# Altium project linux_board.PrjPcb
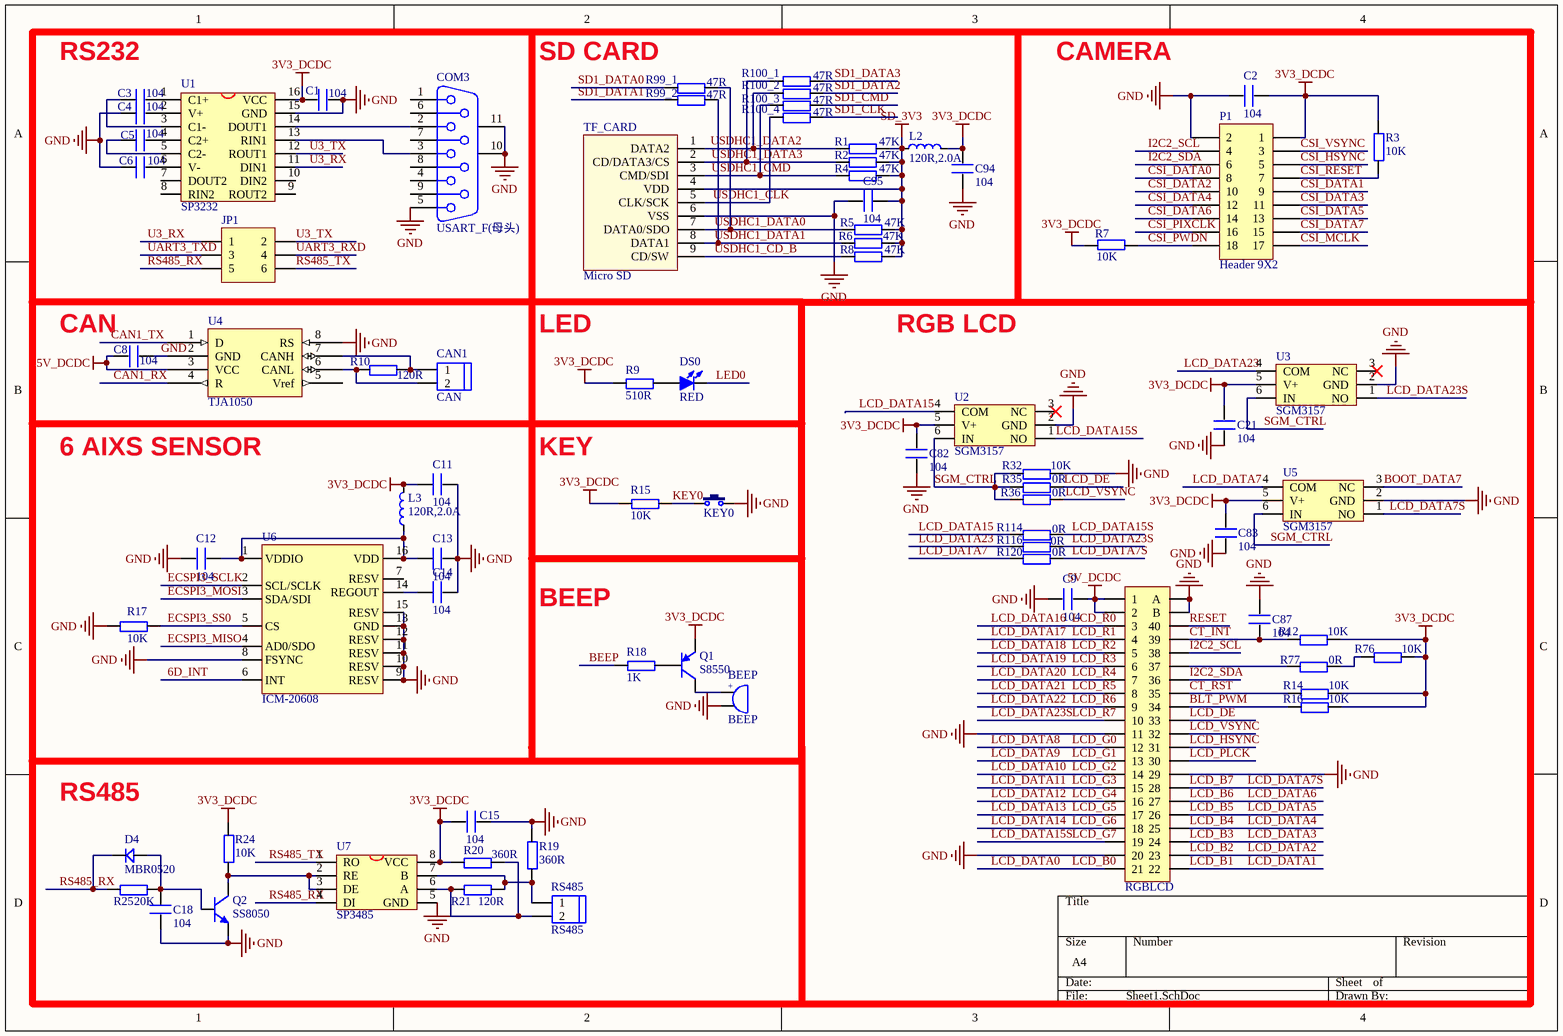
[diagram p0: Sheet1.SchDoc]
5 sheets, 282 parts. Net scope: global (net labels, ports and power ports of the same name join across sheets).
Board file: linux_board_PCB.PcbDoc
Sheets:
  Sheet1.SchDoc
  Sheet2.SchDoc
  Sheet3.SchDoc
  Sheet4.SchDoc
  Sheet5.SchDoc

## Sheet Sheet1.SchDoc
size A4

### Parts
BEEP  BEEP  [BEEP 5x9x5.5]
C1  104  [C 0603]
C2  104  [C 0603]
C3  104  [C 0603]
C4  104  [C 0603]
C5  104  [C 0603]
C6  104  [C 0603]
C8  104  [C 0603]
C9  104  [C 0603]
C11  104  [C 0603]
C12  104  [C 0603]
C13  104  [C 0603]
C14  104  [C 0603]
C15  104  [C 0603]
C18  104  [C 0603]
C21  104  [C 0603]
C82  104  [C 0603]
C83  104  [C 0603]
C87  104  [C 0603]
C94  104  [C 0603]
C95  104  [C 0603]
CAN1  CAN  [KF301-2P]
COM3  USART_F(母头)  [DB9/P_A]
D4  MBR0520  [SOD-123F]
DS0  RED  [LED 0805R]
JP1  RS232/RS485  [HDR-3X2]  (value not drawn)
KEY0  KEY  [TSW DIP-6*6*5 - 2]  (value not drawn)
L2  120R,2.0A  [L 0603]
L3  120R,2.0A  [L 0603]
P1  Header 9X2  [HDR2X9]
Q1  S8550  [SOT23-3L]
Q2  SS8050  [SOT23-3N]
R1  47K  [R 0603]
R2  47K  [R 0603]
R3  10K  [R 0603]
R4  47K  [R 0603]
R5  47K  [R 0603]
R6  47K  [R 0603]
R7  10K  [R 0603]
R8  47K  [R 0603]
R9  510R  [R 0603]
R10  120R  [R 0603]
R12  10K  [R 0603]
R14  10K  [R 0603]
R15  10K  [R 0603]
R16  10K  [R 0603]
R17  10K  [R 0603]
R18  1K  [R 0603]
R19  360R  [R 0603]
R20  360R  [R 0603]
R21  120R  [R 0603]
R24  10K  [R 0603]
R25  20K  [R 0603]
R32  10K  [R 0603]
R35  0R  [R 0603]
R36  0R  [R 0603]
R76  10K  [R 0603]
R77  0R  [R 0603]
R99_1  47R  [R 0603]
R99_2  47R  [R 0603]
R100_1  47R  [R 0603]
R100_2  47R  [R 0603]
R100_3  47R  [R 0603]
R100_4  47R  [R 0603]
R114  0R  [R 0603]
R116  0R  [R 0603]
R120  0R  [R 0603]
RGBLCD  RGBLCD  [FPC0.5-TOP40P]  (value not drawn)
RS485  RS485  [KF301-2P]
TF_CARD  Micro SD  [Micro SD]
U1  SP3232  [SOP16_N]
U2  SGM3157  [SOT363-6L]
U3  SGM3157  [SOT363-6L]
U4  TJA1050  [SOP8_N]
U5  SGM3157  [SOT363-6L]
U6  ICM-20608  [LGA-16-3*3*0.75]
U7  SP3485  [SOP8_N]

### Nets
3V3_DCDC: C1.1 C2.1 C11.1 C15.1 C21.2 C82.2 C83.2 C94.2 L2.2 L3.2 P1.1 Q1.2(E) R3.2 R7.2 R9.1 R12.2 R14.2 R15.1 R16.2 R20.1 R24.2 R76.2 U1.16(VCC) U2.5(V+) U3.5(V+) U5.5(V+) U7.8(VCC)
5V_DCDC: C8.1 C9.1 RGBLCD.1 RGBLCD.2 U4.3(VCC)
GND: BEEP.2 C1.2 C2.2 C4.1 C6.1 C8.2 C9.2 C11.2 C12.1 C13.2 C14.2 C15.2 C18.1 C21.1 C82.1 C83.1 C87.1 C94.1 C95.1 COM3.5 COM3.10(MH1) COM3.11(MH2) KEY0.2 P1.2 Q2.2(E) R17.1 R19.2 R32.2 RGBLCD.11 RGBLCD.20 RGBLCD.29 RGBLCD.41(B) RGBLCD.42(A) TF_CARD.6(VSS) U1.15(GND) U2.2(GND) U3.2(GND) U4.2(GND) U4.8(RS) U5.2(GND) U6.8(FSYNC) U6.9(RESV) U6.10(RESV) U6.11(RESV) U6.12(RESV) U6.13(GND) U6.15(RESV) U7.5(GND)
SD_3V3: C95.2 L2.1 R1.2 R2.2 R4.2 R5.2 R6.2 R8.2 TF_CARD.4(VDD)
6D_INT: U6.6(INT)
BEEP: R18.1
BLT_PWM: R16.1 RGBLCD.34
BOOT_DATA7: U5.3(NC)
CAN1_RX: U4.4(R)
CAN1_TX: U4.1(D)
CSI_DATA0: P1.8
CSI_DATA1: P1.9
CSI_DATA2: P1.10
CSI_DATA3: P1.11
CSI_DATA4: P1.12
CSI_DATA5: P1.13
CSI_DATA6: P1.14
CSI_DATA7: P1.15
CSI_HSYNC: P1.5
CSI_MCLK: P1.17
CSI_PIXCLK: P1.16
CSI_PWDN: P1.18 R7.1
CSI_RESET: P1.7 R3.1
CSI_VSYNC: P1.3
CT_INT: C87.2 R12.1 RGBLCD.39
CT_RST: R14.1 RGBLCD.35
ECSPI3_MISO: U6.4(AD0/SDO)  [project net CAN2_RX]
ECSPI3_MOSI: U6.3(SDA/SDI)  [project net CAN2_TX]
ECSPI3_SCLK: U6.2(SCL/SCLK)
ECSPI3_SS0: R17.2 U6.5(CS)
I2C2_SCL: P1.4 RGBLCD.38
I2C2_SDA: P1.6 RGBLCD.36
KEY0: KEY0.1 R15.2
LCD_B0: RGBLCD.21  [also labelled LCD_DATA0]
LCD_B1: RGBLCD.22  [also labelled LCD_DATA1]
LCD_B2: RGBLCD.23  [also labelled LCD_DATA2]
LCD_B3: RGBLCD.24  [also labelled LCD_DATA3]
LCD_B4: RGBLCD.25  [also labelled LCD_DATA4]
LCD_B5: RGBLCD.26  [also labelled LCD_DATA5]
LCD_B6: RGBLCD.27  [also labelled LCD_DATA6]
LCD_B7: R120.2 RGBLCD.28 U5.1(NO)  [also labelled LCD_DATA7S]
LCD_DATA7: R120.1 U5.4(COM)
LCD_DATA8: RGBLCD.12  [also labelled LCD_G0]
LCD_DATA9: RGBLCD.13  [also labelled LCD_G1]
LCD_DATA10: RGBLCD.14  [also labelled LCD_G2]
LCD_DATA11: RGBLCD.15  [also labelled LCD_G3]
LCD_DATA12: RGBLCD.16  [also labelled LCD_G4]
LCD_DATA13: RGBLCD.17  [also labelled LCD_G5]
LCD_DATA14: RGBLCD.18  [also labelled LCD_G6]
LCD_DATA15: R114.1 U2.4(COM)
LCD_DATA15S: R114.2 RGBLCD.19 U2.1(NO)  [also labelled LCD_G7]
LCD_DATA16: RGBLCD.3  [also labelled LCD_R0]
LCD_DATA17: RGBLCD.4  [also labelled LCD_R1]
LCD_DATA18: RGBLCD.5  [also labelled LCD_R2]
LCD_DATA19: RGBLCD.6  [also labelled LCD_R3]
LCD_DATA20: RGBLCD.7  [also labelled LCD_R4]
LCD_DATA21: RGBLCD.8  [also labelled LCD_R5]
LCD_DATA22: RGBLCD.9  [also labelled LCD_R6]
LCD_DATA23: R116.1 U3.4(COM)
LCD_DATA23S: R116.2 RGBLCD.10 U3.1(NO)  [also labelled LCD_R7]
LCD_DE: R35.2 RGBLCD.33
LCD_HSYNC: RGBLCD.31
LCD_PLCK: RGBLCD.30
LCD_VSYNC: R36.2 RGBLCD.32
LED0: DS0.2(K)  [project net GPIO3]
RESET: RGBLCD.40
RS485_RX: D4.2(K) JP1.5 R25.1 U7.4(DI)
RS485_TX: JP1.6 U7.1(RO)
SD1_CLK: R100_4.2
SD1_CMD: R100_3.2
SD1_DATA0: R99_1.1
SD1_DATA1: R99_2.1
SD1_DATA2: R100_2.2
SD1_DATA3: R100_1.2
SGM_CTRL: R32.1 R35.1 R36.1 U2.6(IN) U3.6(IN) U5.6(IN)
U3_RX: JP1.1 U1.11(DIN1)
U3_TX: JP1.2 U1.12(ROUT1)
UART3_RXD: JP1.4
UART3_TXD: JP1.3
USDHC1_CD_B: R8.1 TF_CARD.9(CD/SW)  [project net UART1_RTS]
USDHC1_CLK: R100_4.1 TF_CARD.5(CLK/SCK)
USDHC1_CMD: R4.1 R100_3.1 TF_CARD.3(CMD/SDI)
USDHC1_DATA0: R5.1 R99_1.2 TF_CARD.7(DATA0/SDO)
USDHC1_DATA1: R6.1 R99_2.2 TF_CARD.8(DATA1)
USDHC1_DATA2: R1.1 R100_2.1 TF_CARD.1(DATA2)
USDHC1_DATA3: R2.1 R100_1.1 TF_CARD.2(CD/DATA3/CS)
NetBEEP_1: BEEP.1 Q1.3(C)
NetC3_1: C3.1 U1.3(C1-)
NetC3_2: C3.2 U1.1(C1+)
NetC4_2: C4.2 U1.2(V+)
NetC5_1: C5.1 U1.5(C2-)
NetC5_2: C5.2 U1.4(C2+)
NetC6_2: C6.2 U1.6(V-)
NetC12_2: C12.2 C13.1 L3.1 U6.1(VDDIO) U6.16(VDD)
NetC14_1: C14.1 U6.14(REGOUT)
NetC18_2: C18.2 D4.1(A) Q2.1(B) R25.2
NetCAN1_1: CAN1.1 R10.2 U4.7(CANH)
NetCAN1_2: CAN1.2 R10.1 U4.6(CANL)
NetCOM3_2: COM3.2 U1.14(DOUT1)
NetCOM3_3: COM3.3 U1.13(RIN1)
NetDS0_1: DS0.1(A) R9.2
NetQ1_1: Q1.1(B) R18.2
NetQ2_3: Q2.3(C) R24.1 U7.2(RE) U7.3(DE)
NetR19_1: R19.1 R21.2 RS485.1 U7.7(B)
NetR20_2: R20.2 R21.1 RS485.2 U7.6(A)
NetR76_1: R76.1 R77.2
NetR77_1: R77.1 RGBLCD.37

Not connected (* = marked no-connect by the designer): COM3 1 4 6 7 8 9; U1 7(DOUT2) 8(RIN2) 9(ROUT2) 10(DIN2); U2 3(NC)*; U3 3(NC)*; U4 5(Vref); U6 7(RESV)

### Notes on the sheet
- RS232
- SD CARD
- CAMERA
- (near C8) CAN
- LED
- RGB LCD
- 6 AIXS SENSOR
- KEY
- BEEP
- (near D4) RS485
- (in symbol BEEP) +

### Library data of the parts
BEEP = BEEP: 蜂鸣器; 版权归属: 源创客; BOM名称: 蜂鸣器; 学习资源: www.ooocke.com
C1-C6 C8 C9 C11-C15 C18 C21 C82 C83 C87 C94 C95 = C
CAN1 RS485 = HEAD2
COM3 = DB9: 9针串口; 版权归属: 源创客; BOM名称: 9针串口; 学习资源: www.ooocke.com
D4 = SS14: 肖特基二极管; 版权归属: 源创客; 属性: 40V/1A; BOM名称: 肖特基二极管; 学习资源: www.ooocke.com
DS0 = LED-SMD: 贴片LED; 版权归属: 源创客; BOM名称: 贴片LED; 学习资源: www.ooocke.com
JP1 = Header 3X2: 3*2P接插件; 版权归属: 源创客; BOM名称: 3*2P接插件; 学习资源: www.ooocke.com
KEY0 = KEY: 按键; BOM名称: 3x6轻触开关; 版权归属: 源创客; 学习资源: www.ooocke.com
L2 L3 = L: 小功率贴片电感磁珠; 版权归属: 源创客; BOM名称: 小功率贴片电感; 学习资源: www.ooocke.com
P1 = Header 9X2: Header, 9-Pin, Dual row; LatestRevisionDate: 17-Jul-2002; LatestRevisionNote: Re-released for DXP Platform.; Publisher: Altium Limited
Q1 = 8550-SMD: 高频放大-PNP型; 版权归属: 源创客; 属性: 40V 1.5A 1W 100MHZ; BOM名称: 高频放大-PNP型; 学习资源: www.ooocke.com
Q2 = 8050-SMD: 高频放大-NPN型; 版权归属: 源创客; 属性: 40V 1.5A 1W 100MHZ; BOM名称: 高频放大-NPN型; 学习资源: www.ooocke.com
R1-R10 R12 R14-R21 R24 R25 R32 R35 R36 R76 R77 R99_1 R99_2 R100_1-R100_4 R114 R116 R120 = R
RGBLCD = RGBLCD: 16*2P接插件; 版权归属: 源创客; BOM名称: 16*2P接插件; 学习资源: www.ooocke.com
TF_CARD = Micro SD: Micro SD卡; 版权归属: 源创客; BOM名称: Micro SD卡; 学习资源: www.ooocke.com
U1 = MAX3232
U2 U3 U5 = SGM3157: 单路双掷模拟开关
U4 = SN65HVD230D
U6 = ICM20608: 三轴陀螺仪/三轴加速度计,
U7 = MAX3485

## Sheet Sheet2.SchDoc
size A4
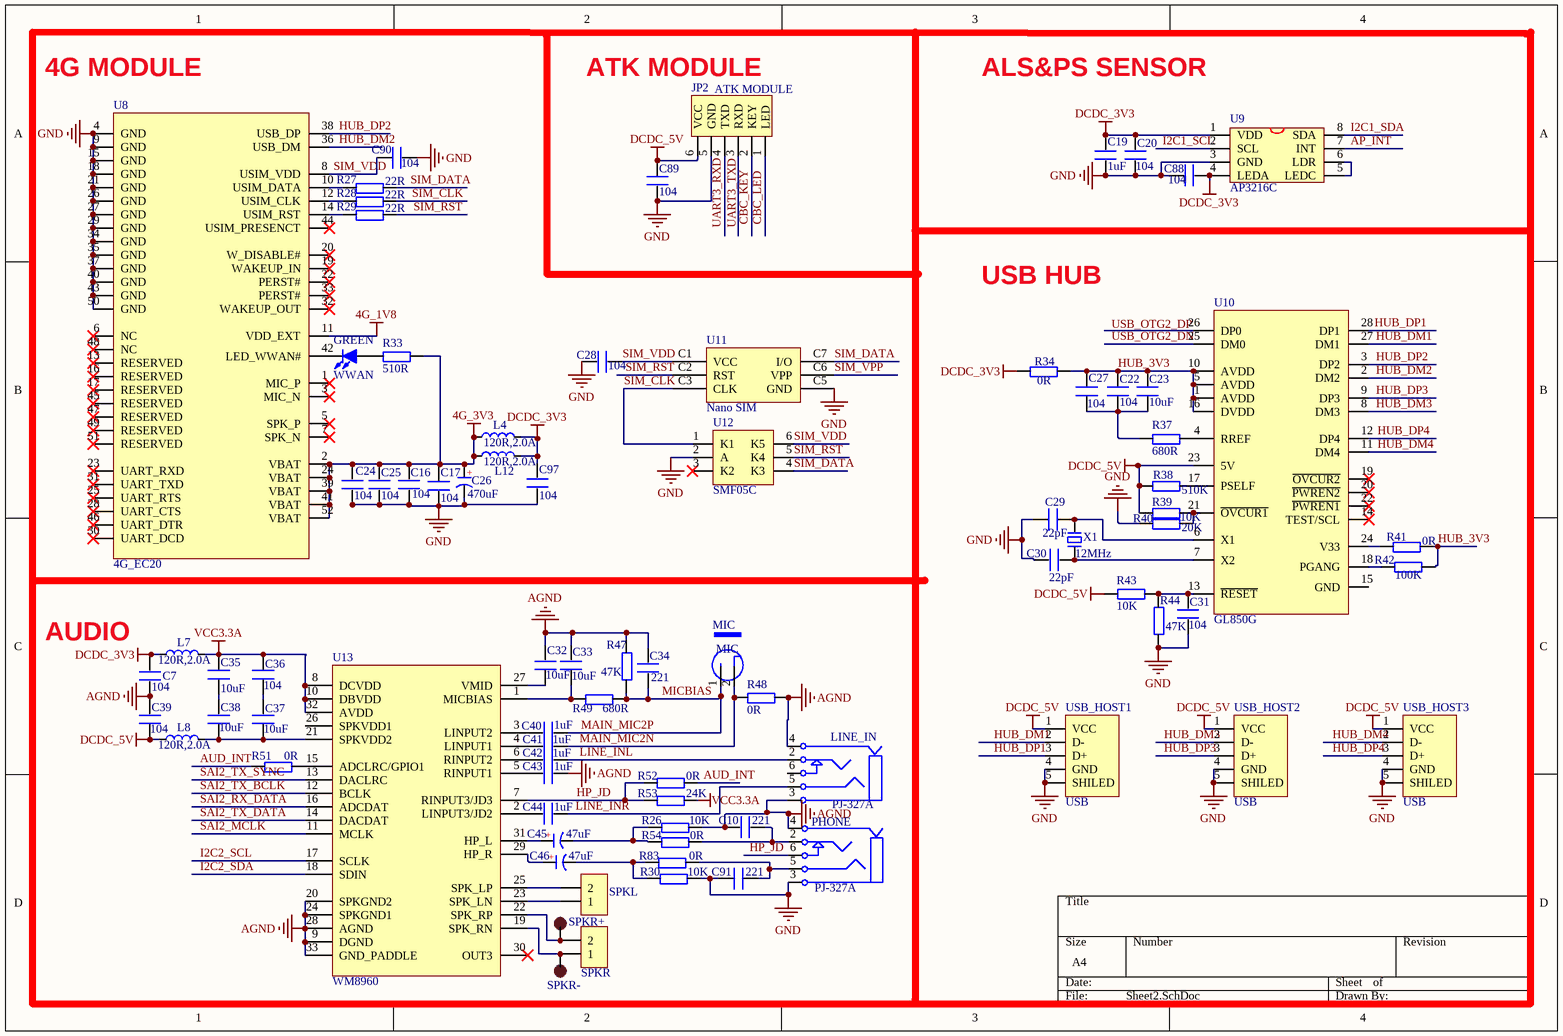
[diagram p1: Sheet2.SchDoc]

### Parts
C7  104  [C 0603]
C10  221  [C 0603]
C16  104  [C 0603]
C17  104  [C 0603]
C19  1uF  [C 0603]
C20  104  [C 0603]
C22  104  [C 0603]
C23  10uF  [C 0603]
C24  104  [C 0603]
C25  104  [C 0603]
C26  470uF  [CM D(6.3*5.4)]
C27  104  [C 0603]
C28  104  [C 0603]
C29  22pF  [C 0603]
C30  22pF  [C 0603]
C31  104  [C 0603]
C32  10uF  [C 0603]
C33  10uF  [C 0603]
C34  221  [C 0603]
C35  10uF  [C 0603]
C36  104  [C 0603]
C37  10uF  [C 0603]
C38  10uF  [C 0603]
C39  104  [C 0603]
C40  1uF  [C 0603]
C41  1uF  [C 0603]
C42  1uF  [C 0603]
C43  1uF  [C 0603]
C44  1uF  [C 0603]
C45  47uF  [CM D(6.3*5.4)]
C46  47uF  [CM D(6.3*5.4)]
C88  104  [C 0603]
C89  104  [C 0603]
C90  104  [C 0603]
C91  221  [C 0603]
C97  104  [C 0603]
GREEN  WWAN  [LED 0805R]
JP2  ATK MODULE  [HEAD6]
L4  120R,2.0A  [L 0603]
L7  120R,2.0A  [L 0603]
L8  120R,2.0A  [L 0603]
L12  120R,2.0A  [L 0603]
LINE_IN  PJ-327A  [PJ327A]
MIC  MIC  [MIC-6022]
PHONE  PJ-327A  [PJ327A]
R26  10K  [R 0603]
R27  22R  [R 0603]
R28  22R  [R 0603]
R29  22R  [R 0603]
R30  10K  [R 0603]
R33  510R  [R 0603]
R34  0R  [R 0603]
R37  680R  [R 0603]
R38  510K  [R 0603]
R39  10K  [R 0603]
R40  20K  [R 0603]
R41  0R  [R 0603]
R42  100K  [R 0603]
R43  10K  [R 0603]
R44  47K  [R 0603]
R47  47K  [R 0603]
R48  0R  [R 0603]
R49  680R  [R 0603]
R51  0R  [R 0603]
R52  0R  [R 0603]
R53  24K  [R 0603]
R54  0R  [R 0603]
R83  0R  [R 0603]
SPKL  SPKL  [XH2.54-2P_H]  (value not drawn)
SPKR  SPKL  [XH2.54-2P_H]  (value not drawn)
SPKR+  SPK+  [TP-1.5]  (value not drawn)
SPKR-  SPK+  [TP-1.5]  (value not drawn)
U8  4G_EC20  [Mini PCIE 52P]
U9  AP3216C  [QFN8]
U10  GL850G  [SSOP28_L]
U11  Nano SIM  [Nano SIM 7P]
U12  SMF05C  [SOT363-6L]
U13  WM8960  [QFN32 5x5_L]
USB_HOST1  USB  [USB-A/S_E]
USB_HOST2  USB  [USB-A/S_E]
USB_HOST3  USB  [USB-A/S_E]
X1  12MHz  [XTAL-49S DIP]

### Nets
4G_1V8: U8.11(VDD_EXT)
4G_3V3: C16.2 C17.2 C24.2 C25.2 C26.1(A) L4.1 L12.1 R33.2 U8.2(VBAT) U8.24(VBAT) U8.39(VBAT) U8.41(VBAT) U8.52(VBAT)
AGND: C7.1 C10.1 C32.1 C33.2 C34.2 C39.2 C43.2 LINE_IN.3 LINE_IN.4 PHONE.4 R26.2 R47.2 R48.2 U13.9(DGND) U13.20(SPKGND2) U13.24(SPKGND1) U13.28(AGND) U13.33(GND_PADDLE)
DCDC_3V3: C7.2 C19.2 C20.2 C88.1 C97.2 L4.2 L7.1 L12.2 R34.1 U9.1(VDD) U9.4(LEDA)
DCDC_5V: C39.1 C89.1 JP2.6(VCC) L8.1 R38.1 R39.1 R43.1 U10.23(5V) USB_HOST1.1(VCC) USB_HOST2.1(VCC) USB_HOST3.1(VCC)  [project net CORE_5V]
GND: C16.1 C17.1 C19.1 C20.1 C24.1 C25.1 C26.2(K) C28.2 C29.2 C30.2 C31.2 C88.2 C89.2 C90.2 C91.1 C97.1 JP2.5(GND) PHONE.3 R30.2 R40.1 R44.1 U8.4(GND) U8.9(GND) U8.15(GND) U8.18(GND) U8.21(GND) U8.26(GND) U8.27(GND) U8.29(GND) U8.34(GND) U8.35(GND) U8.37(GND) U8.40(GND) U8.43(GND) U8.50(GND) U9.3(GND) U11.C5(GND) U12.2(A) USB_HOST1.4(GND) USB_HOST1.5(SHILED) USB_HOST2.4(GND) USB_HOST2.5(SHILED) USB_HOST3.4(GND) USB_HOST3.5(SHILED)
VCC3.3A: C35.2 C36.2 L7.2 R53.2 U13.8(DCVDD) U13.10(DBVDD) U13.32(AVDD)
AP_INT: U9.7(INT)
AUD_INT: R51.1 R52.2
CBC_KEY: JP2.2(KEY)
CBC_LED: JP2.1(LED)
HP_JD: PHONE.6 R52.1 R53.1 U13.7(RINPUT3/JD3)
HUB_3V3: C22.2 C23.2 C27.2 R34.2 R41.2 R42.2 U10.1(AVDD) U10.5(AVDD) U10.10(AVDD) U10.16(DVDD)
HUB_DM1: U10.27(DM1) USB_HOST1.2(D-)
HUB_DM2: U8.36(USB_DM) U10.2(DM2)
HUB_DM3: U10.8(DM3) USB_HOST2.2(D-)
HUB_DM4: U10.11(DM4) USB_HOST3.2(D-)
HUB_DP1: U10.28(DP1) USB_HOST1.3(D+)
HUB_DP2: U8.38(USB_DP) U10.3(DP2)
HUB_DP3: U10.9(DP3) USB_HOST2.3(D+)
HUB_DP4: U10.12(DP4) USB_HOST3.3(D+)
I2C1_SCL: U9.2(SCL)
I2C1_SDA: U9.8(SDA)
I2C2_SCL: U13.17(SCLK)
I2C2_SDA: U13.18(SDIN)
LINE_INL: C42.2 LINE_IN.2
LINE_INR: C44.2 LINE_IN.5
MAIN_MIC2N: C41.2 MIC.2(GND) R48.1
MAIN_MIC2P: C34.1 C40.2 MIC.1(VCC) R47.1 R49.2  [also labelled MICBIAS]
SAI2_MCLK: U13.11(MCLK)  [project net JTAG_TMS]
SAI2_RX_DATA: U13.16(ADCDAT)  [project net JTAG_TCK]
SAI2_TX_BCLK: U13.12(BCLK)  [project net JTAG_TDI]
SAI2_TX_DATA: U13.14(DACDAT)  [project net JTAG_nTRST]
SAI2_TX_SYNC: U13.13(DACLRC)  [project net JTAG_TDO]
SIM_CLK: R28.2 U11.C3(CLK) U12.1(K1)
SIM_DATA: R27.2 U11.C7(I/O) U12.4(K3)
SIM_RST: R29.2 U11.C2(RST) U12.5(K4)
SIM_VDD: C28.1 C90.1 U8.8(USIM_VDD) U11.C1(VCC) U12.6(K5)
SIM_VPP: U11.C6(VPP)
UART3_RXD: JP2.4(TXD)
USB_OTG2_DN: U10.25(DM0)
NetC10_2: C10.2 PHONE.2 R54.2
NetC22_1: C22.1 C23.1 C27.1 R37.1
NetC29_1: C29.1 U10.6(X1) X1.2
NetC30_1: C30.1 U10.7(X2) X1.1
NetC31_1: C31.1 R43.2 R44.2 U10.13(~{RESET})
NetC32_2: C32.2 U13.27(VMID)
NetC33_1: C33.1 R49.1 U13.1(MICBIAS)
NetC35_1: C35.1 C38.2
NetC36_1: C36.1 C37.2
NetC37_1: C37.1 C38.1 L8.2 U13.21(SPKVDD2)
NetC40_1: C40.1 U13.3(LINPUT2)
NetC41_1: C41.1 U13.4(LINPUT1)
NetC42_1: C42.1 U13.6(RINPUT2)
NetC43_1: C43.1 U13.5(RINPUT1)
NetC44_1: C44.1 U13.2(LINPUT3/JD2)
NetC45_1: C45.1(A) U13.31(HP_L)
NetC45_2: C45.2(K) R26.1 R54.1
NetC46_1: C46.1(A) U13.29(HP_R)
NetC46_2: C46.2(K) R30.1 R83.1
NetC91_2: C91.2 PHONE.5 R83.2
NetGREEN_1: GREEN.1(A) R33.1
NetGREEN_2: GREEN.2(K) U8.42(LED_WWAN#)
NetR27_1: R27.1 U8.10(USIM_DATA)
NetR28_1: R28.1 U8.12(USIM_CLK)
NetR29_1: R29.1 U8.14(USIM_RST)
NetR37_2: R37.2 U10.4(RREF)
NetR38_2: R38.2 U10.17(PSELF)
NetR39_2: R39.2 R40.2 U10.21(~{OVCUR1})
NetR41_1: R41.1 U10.24(V33)
NetR42_1: R42.1 U10.18(PGANG)
NetR51_2: R51.2 U13.15(ADCLRC/GPIO1)
NetSPKL_1: SPKL.1 U13.23(SPK_LN)
NetSPKL_2: SPKL.2 U13.25(SPK_LP)
NetSPKR_1: SPKR.1 SPKR-.1 U13.19(SPK_RN)
NetSPKR_2: SPKR.2 SPKR+.1 U13.22(SPK_RP)
NetU9_5: U9.5(LEDC) U9.6(LDR)

Not connected (* = marked no-connect by the designer): JP2 3(RXD); LINE_IN 6; U8 1(MIC_P)* 3(MIC_N)* 5(SPK_P)* 6(NC)* 7(SPK_N)* 13(RESERVED)* 16(RESERVED)* 17(RESERVED)* 19(WAKEUP_IN)* 20(W_DISABLE#)* 22(PERST#)* 23(UART_RXD)* 25(UART_RTS)* 28(UART_CTS)* 30(UART_DCD)* 31(UART_TXD)* 32(WAKEUP_OUT)* 33(PERST#)* 44(USIM_PRESENCT)* 45(RESERVED)* 46(UART_DTR)* 47(RESERVED)* 48(NC)* 49(RESERVED)* 51(RESERVED)*; U10 14(TEST/SCL)* 15(GND) 19(~{OVCUR2})* 20(~{PWREN2})* 22(~{PWREN1})* 26(DP0); U11 C4(NC); U12 3(K2)*; U13 26(SPKVDD1) 30(OUT3)*

### Notes on the sheet
- (near U8) 4G MODULE
- (near JP2) ATK MODULE
- ALS&PS SENSOR
- USB HUB
- AUDIO
- Labels drawn without touching a wire or pin: UART3_TXD, USB_OTG2_DP
- (in symbol C-CM) +

### Library data of the parts
C7 C10 C16 C17 C19 C20 C22-C25 C27-C44 C88-C91 C97 = C
C26 C45 C46 = C-CM: 贴片电解电容; 版权归属: 源创客; BOM名称: 贴片电解电容; 学习资源: www.ooocke.com
GREEN = LED-SMD: 贴片LED; 版权归属: 源创客; BOM名称: 贴片LED; 学习资源: www.ooocke.com
JP2 = ATK-HC05
L4 L7 L8 L12 = L: 小功率贴片电感磁珠; 版权归属: 源创客; BOM名称: 小功率贴片电感; 学习资源: www.ooocke.com
R26-R30 R33 R34 R37-R44 R47-R49 R51-R54 R83 = R
SPKL SPKR = Header 2: 2P接插件; 版权归属: 源创客; BOM名称: 2P接插件; 学习资源: www.ooocke.com
SPKR+ SPKR- = TEST-POINT: 测试点
U8 = 4G-EC20
U9 = AP3216C: ALS+PS Sensor
USB_HOST1-USB_HOST3 = USB-A/S: USB-A型母接口; 版权归属: 源创客; BOM名称: USB-A型母接口; 学习资源: www.ooocke.com
X1 = XTAL-2P: 2脚无源晶振; BOM名称: 2脚晶振; 版权归属: 源创客; 学习资源: www.ooocke.com

## Sheet Sheet3.SchDoc
size A4
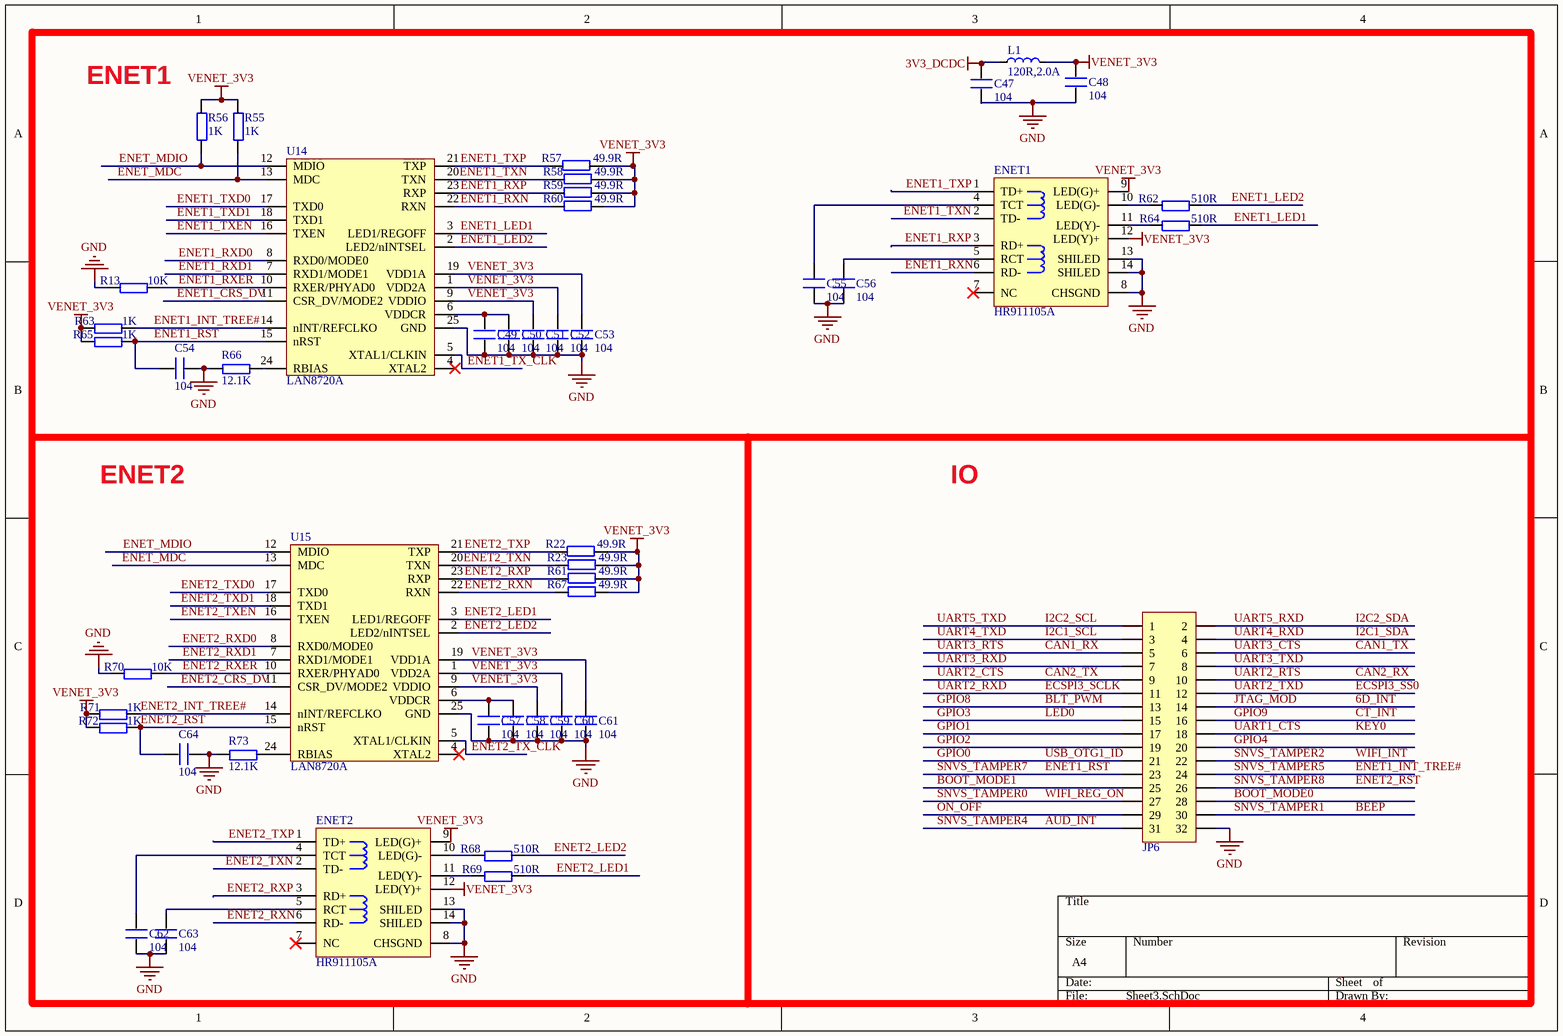
[diagram p2: Sheet3.SchDoc]

### Parts
C47  104  [C 0603]
C48  104  [C 0603]
C49  104  [C 0603]
C50  104  [C 0603]
C51  104  [C 0603]
C52  104  [C 0603]
C53  104  [C 0603]
C54  104  [C 0603]
C55  104  [C 0603]
C56  104  [C 0603]
C57  104  [C 0603]
C58  104  [C 0603]
C59  104  [C 0603]
C60  104  [C 0603]
C61  104  [C 0603]
C62  104  [C 0603]
C63  104  [C 0603]
C64  104  [C 0603]
ENET1  HR911105A  [RJ-45A12]
ENET2  HR911105A  [RJ-45A12]
JP6  Header 2X11  [HDR-16X2]  (value not drawn)
L1  120R,2.0A  [L 0603]
R13  10K  [R 0603]
R22  49.9R  [R 0603]
R23  49.9R  [R 0603]
R55  1K  [R 0603]
R56  1K  [R 0603]
R57  49.9R  [R 0603]
R58  49.9R  [R 0603]
R59  49.9R  [R 0603]
R60  49.9R  [R 0603]
R61  49.9R  [R 0603]
R62  510R  [R 0603]
R63  1K  [R 0603]
R64  510R  [R 0603]
R65  1K  [R 0603]
R66  12.1K  [R 0603]
R67  49.9R  [R 0603]
R68  510R  [R 0603]
R69  510R  [R 0603]
R70  10K  [R 0603]
R71  1K  [R 0603]
R72  1K  [R 0603]
R73  12.1K  [R 0603]
U14  LAN8720A  [QFN24]
U15  LAN8720A  [QFN24]

### Nets
3V3_DCDC: C47.2 L1.1
GND: C47.1 C48.1 C49.1 C50.1 C51.1 C52.1 C53.1 C54.1 C55.1 C56.1 C57.1 C58.1 C59.1 C60.1 C61.1 C62.1 C63.1 C64.1 ENET1.8(CHSGND) ENET1.13(SHILED) ENET1.14(SHILED) ENET2.8(CHSGND) ENET2.13(SHILED) ENET2.14(SHILED) JP6.32 R13.1 R66.1 R70.1 R73.1 U14.25(GND) U15.25(GND)
VENET_3V3: C48.2 C51.2 C52.2 C53.2 C59.2 C60.2 C61.2 ENET1.9(LED(G)+) ENET1.12(LED(Y)+) ENET2.9(LED(G)+) ENET2.12(LED(Y)+) L1.2 R22.1 R23.1 R55.2 R56.2 R57.1 R58.1 R59.1 R60.1 R61.1 R63.1 R65.1 R67.1 R71.1 R72.1 U14.1(VDD2A) U14.9(VDDIO) U14.19(VDD1A) U15.1(VDD2A) U15.9(VDDIO) U15.19(VDD1A)
6D_INT: JP6.14  [also labelled JTAG_MOD]
AUD_INT: JP6.29 JP6.31  [also labelled ON_OFF, SNVS_TAMPER4]
BEEP: JP6.30  [also labelled SNVS_TAMPER1]
BLT_PWM: JP6.13  [also labelled GPIO8]
BOOT_MODE0: JP6.28
BOOT_MODE1: JP6.25
CAN1_RX: JP6.5  [also labelled UART3_RTS]
CAN1_TX: JP6.6  [also labelled UART3_CTS]
CAN2_RX: JP6.10  [also labelled UART2_RTS]
CAN2_TX: JP6.9  [also labelled UART2_CTS]
CT_INT: JP6.16  [also labelled GPIO9]
ECSPI3_SCLK: JP6.11  [also labelled UART2_RXD]
ECSPI3_SS0: JP6.12  [also labelled UART2_TXD]
ENET1_CRS_DV: U14.11(CSR_DV/MODE2)
ENET1_INT_TREE#: JP6.24 R63.2 U14.14(nINT/REFCLKO)  [also labelled SNVS_TAMPER5]
ENET1_LED1: R64.2 U14.3(LED1/REGOFF)
ENET1_LED2: R62.2 U14.2(LED2/nINTSEL)
ENET1_RST: C54.2 JP6.23 R65.2 U14.15(nRST)  [also labelled SNVS_TAMPER7]
ENET1_RXD0: U14.8(RXD0/MODE0)
ENET1_RXD1: U14.7(RXD1/MODE1)
ENET1_RXER: R13.2 U14.10(RXER/PHYAD0)
ENET1_RXN: ENET1.6(RD-) R60.2 U14.22(RXN)
ENET1_RXP: ENET1.3(RD+) R59.2 U14.23(RXP)
ENET1_TX_CLK: U14.5(XTAL1/CLKIN)
ENET1_TXD0: U14.17(TXD0)
ENET1_TXD1: U14.18(TXD1)
ENET1_TXEN: U14.16(TXEN)
ENET1_TXN: ENET1.2(TD-) R58.2 U14.20(TXN)
ENET1_TXP: ENET1.1(TD+) R57.2 U14.21(TXP)
ENET2_CRS_DV: U15.11(CSR_DV/MODE2)
ENET2_INT_TREE#: R71.2 U15.14(nINT/REFCLKO)
ENET2_LED1: R69.2 U15.3(LED1/REGOFF)
ENET2_LED2: R68.2 U15.2(LED2/nINTSEL)
ENET2_RST: C64.2 JP6.26 R72.2 U15.15(nRST)  [also labelled SNVS_TAMPER8]
ENET2_RXD0: U15.8(RXD0/MODE0)
ENET2_RXD1: U15.7(RXD1/MODE1)
ENET2_RXER: R70.2 U15.10(RXER/PHYAD0)
ENET2_RXN: ENET2.6(RD-) R67.2 U15.22(RXN)
ENET2_RXP: ENET2.3(RD+) R61.2 U15.23(RXP)
ENET2_TX_CLK: U15.5(XTAL1/CLKIN)
ENET2_TXD0: U15.17(TXD0)
ENET2_TXD1: U15.18(TXD1)
ENET2_TXEN: U15.16(TXEN)
ENET2_TXN: ENET2.2(TD-) R23.2 U15.20(TXN)
ENET2_TXP: ENET2.1(TD+) R22.2 U15.21(TXP)
ENET_MDC: R55.1 U14.13(MDC) U15.13(MDC)
ENET_MDIO: R56.1 U14.12(MDIO) U15.12(MDIO)
GPIO0: JP6.21  [also labelled USB_OTG1_ID]
GPIO1: JP6.17  [project net AP_INT]
GPIO2: JP6.19  [project net CSI_RESET]
GPIO3: JP6.15  [also labelled LED0]
GPIO4: JP6.20  [project net CSI_PWDN]
I2C1_SCL: JP6.3  [also labelled UART4_TXD]
I2C1_SDA: JP6.4  [also labelled UART4_RXD]
I2C2_SCL: JP6.1  [also labelled UART5_TXD]
I2C2_SDA: JP6.2  [also labelled UART5_RXD]
KEY0: JP6.18  [also labelled UART1_CTS]
SNVS_TAMPER0: JP6.27  [also labelled WIFI_REG_ON]
SNVS_TAMPER2: JP6.22  [also labelled WIFI_INT]
UART3_RXD: JP6.7
UART3_TXD: JP6.8
NetC49_2: C49.2 C50.2 U14.6(VDDCR)
NetC55_2: C55.2 ENET1.4(TCT)
NetC56_2: C56.2 ENET1.5(RCT)
NetC57_2: C57.2 C58.2 U15.6(VDDCR)
NetC62_2: C62.2 ENET2.4(TCT)
NetC63_2: C63.2 ENET2.5(RCT)
NetENET1_10: ENET1.10(LED(G)-) R62.1
NetENET1_11: ENET1.11(LED(Y)-) R64.1
NetENET2_10: ENET2.10(LED(G)-) R68.1
NetENET2_11: ENET2.11(LED(Y)-) R69.1
NetR66_2: R66.2 U14.24(RBIAS)
NetR73_2: R73.2 U15.24(RBIAS)

Not connected (* = marked no-connect by the designer): ENET1 7(NC)*; ENET2 7(NC)*; U14 4(XTAL2)*; U15 4(XTAL2)*

### Notes on the sheet
- (near R56) ENET1
- ENET2
- IO

### Library data of the parts
C47-C64 = C
ENET1 ENET2 = HR911105A: 带灯以太网接口; 版权归属: 源创客; BOM名称: 带灯以太网接口; 学习资源: www.ooocke.com
JP6 = Header 16X2: 16*2P接插件; 版权归属: 源创客; BOM名称: 16*2P接插件; 学习资源: www.ooocke.com
L1 = L: 小功率贴片电感磁珠; 版权归属: 源创客; BOM名称: 小功率贴片电感; 学习资源: www.ooocke.com
R13 R22 R23 R55-R73 = R
U14 U15 = LAN8720: ETH PHY

## Sheet Sheet4.SchDoc
size A4
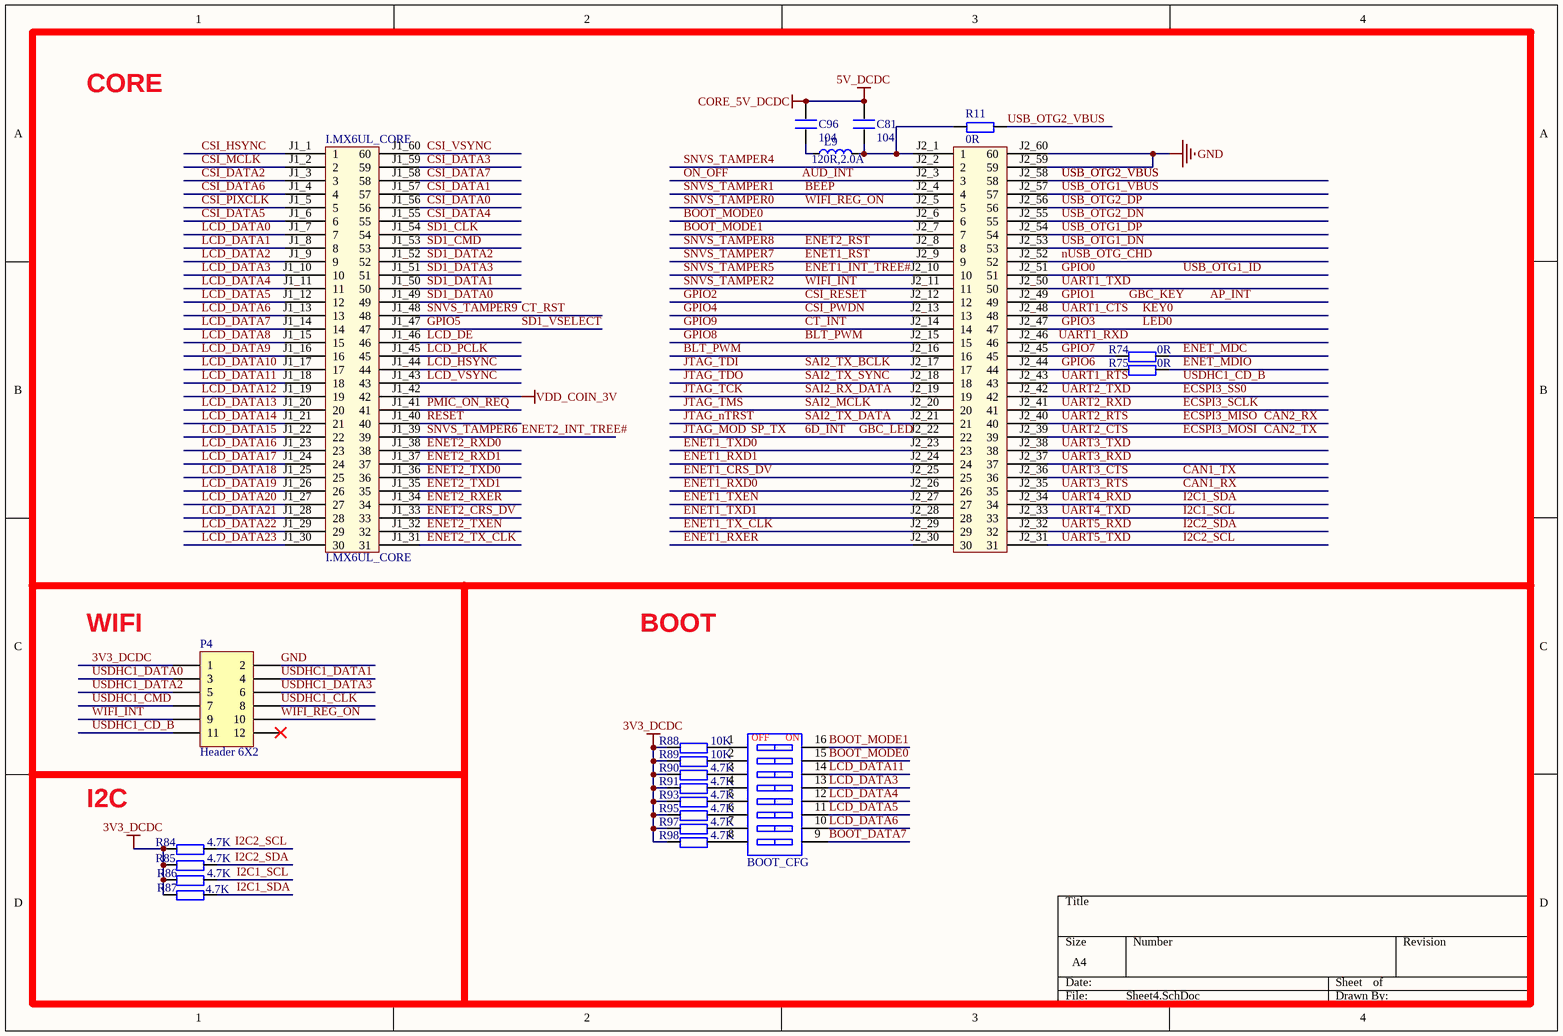
[diagram p3: Sheet4.SchDoc]

### Parts
BOOT_CFG  CSW-8P  [CSW DIP-8P]  (value not drawn)
C81  104  [C 0603]
C96  104  [C 0603]
I.MX6UL_CORE  I.MX6UL_CORE  [I.MX6UL_CORE]
L9  120R,2.0A  [L 0603]
P4  Header 6X2  [HDR2X6]
R11  0R  [R 0603]
R74  0R  [R 0603]
R75  0R  [R 0603]
R84  4.7K  [R 0603]
R85  4.7K  [R 0603]
R86  4.7K  [R 0603]
R87  4.7K  [R 0603]
R88  10K  [R 0603]
R89  10K  [R 0603]
R90  4.7K  [R 0603]
R91  4.7K  [R 0603]
R93  4.7K  [R 0603]
R95  4.7K  [R 0603]
R97  4.7K  [R 0603]
R98  4.7K  [R 0603]

### Nets
3V3_DCDC: P4.1 R84.1 R85.1 R86.1 R87.1 R88.1 R89.1 R90.1 R91.1 R93.1 R95.1 R97.1 R98.1
5V_DCDC: C81.2 C96.2  [also labelled CORE_5V_DCDC]
GND: I.MX6UL_CORE.J2_59(59) I.MX6UL_CORE.J2_60(60) P4.2
VDD_COIN_3V: I.MX6UL_CORE.J1_42(42)
6D_INT: I.MX6UL_CORE.J2_22(22)  [also labelled GBC_LED, JTAG_MOD, SP_TX]
AP_INT: I.MX6UL_CORE.J2_49(49)  [also labelled GBC_KEY, GPIO1]
AUD_INT: I.MX6UL_CORE.J2_2(2) I.MX6UL_CORE.J2_3(3)  [also labelled ON_OFF, SNVS_TAMPER4]
BEEP: I.MX6UL_CORE.J2_4(4)  [also labelled SNVS_TAMPER1]
BLT_PWM: I.MX6UL_CORE.J2_15(15) I.MX6UL_CORE.J2_16(16)  [also labelled GPIO8]
BOOT_DATA7: BOOT_CFG.9
BOOT_MODE0: BOOT_CFG.15 I.MX6UL_CORE.J2_6(6)
BOOT_MODE1: BOOT_CFG.16 I.MX6UL_CORE.J2_7(7)
CAN1_RX: I.MX6UL_CORE.J2_35(35)  [also labelled UART3_RTS]
CAN1_TX: I.MX6UL_CORE.J2_36(36)  [also labelled UART3_CTS]
CAN2_RX: I.MX6UL_CORE.J2_40(40)  [also labelled ECSPI3_MISO, UART2_RTS]
CAN2_TX: I.MX6UL_CORE.J2_39(39)  [also labelled ECSPI3_MOSI, UART2_CTS]
CSI_DATA0: I.MX6UL_CORE.J1_56(56)
CSI_DATA1: I.MX6UL_CORE.J1_57(57)
CSI_DATA2: I.MX6UL_CORE.J1_3(3)
CSI_DATA3: I.MX6UL_CORE.J1_59(59)
CSI_DATA4: I.MX6UL_CORE.J1_55(55)
CSI_DATA5: I.MX6UL_CORE.J1_6(6)
CSI_DATA6: I.MX6UL_CORE.J1_4(4)
CSI_DATA7: I.MX6UL_CORE.J1_58(58)
CSI_HSYNC: I.MX6UL_CORE.J1_1(1)
CSI_MCLK: I.MX6UL_CORE.J1_2(2)
CSI_PIXCLK: I.MX6UL_CORE.J1_5(5)
CSI_PWDN: I.MX6UL_CORE.J2_13(13)  [also labelled GPIO4]
CSI_RESET: I.MX6UL_CORE.J2_12(12)  [also labelled GPIO2]
CSI_VSYNC: I.MX6UL_CORE.J1_60(60)
CT_INT: I.MX6UL_CORE.J2_14(14)  [also labelled GPIO9]
CT_RST: I.MX6UL_CORE.J1_48(48)  [also labelled SNVS_TAMPER9]
ECSPI3_SCLK: I.MX6UL_CORE.J2_41(41)  [also labelled UART2_RXD]
ECSPI3_SS0: I.MX6UL_CORE.J2_42(42)  [also labelled UART2_TXD]
ENET1_CRS_DV: I.MX6UL_CORE.J2_25(25)
ENET1_INT_TREE#: I.MX6UL_CORE.J2_10(10)  [also labelled SNVS_TAMPER5]
ENET1_RST: I.MX6UL_CORE.J2_9(9)  [also labelled SNVS_TAMPER7]
ENET1_RXD0: I.MX6UL_CORE.J2_26(26)
ENET1_RXD1: I.MX6UL_CORE.J2_24(24)
ENET1_RXER: I.MX6UL_CORE.J2_30(30)
ENET1_TX_CLK: I.MX6UL_CORE.J2_29(29)
ENET1_TXD0: I.MX6UL_CORE.J2_23(23)
ENET1_TXD1: I.MX6UL_CORE.J2_28(28)
ENET1_TXEN: I.MX6UL_CORE.J2_27(27)
ENET2_CRS_DV: I.MX6UL_CORE.J1_33(33)
ENET2_INT_TREE#: I.MX6UL_CORE.J1_39(39)  [also labelled SNVS_TAMPER6]
ENET2_RST: I.MX6UL_CORE.J2_8(8)  [also labelled SNVS_TAMPER8]
ENET2_RXD0: I.MX6UL_CORE.J1_38(38)
ENET2_RXD1: I.MX6UL_CORE.J1_37(37)
ENET2_RXER: I.MX6UL_CORE.J1_34(34)
ENET2_TX_CLK: I.MX6UL_CORE.J1_31(31)
ENET2_TXD0: I.MX6UL_CORE.J1_36(36)
ENET2_TXD1: I.MX6UL_CORE.J1_35(35)
ENET2_TXEN: I.MX6UL_CORE.J1_32(32)
ENET_MDC: R74.2
ENET_MDIO: R75.2
GPIO0: I.MX6UL_CORE.J2_51(51)  [also labelled USB_OTG1_ID]
GPIO3: I.MX6UL_CORE.J2_47(47)  [also labelled LED0]
GPIO5: I.MX6UL_CORE.J1_47(47)  [also labelled SD1_VSELECT]
GPIO6: I.MX6UL_CORE.J2_44(44) R75.1
GPIO7: I.MX6UL_CORE.J2_45(45) R74.1
I2C1_SCL: I.MX6UL_CORE.J2_33(33) R86.2  [also labelled UART4_TXD]
I2C1_SDA: I.MX6UL_CORE.J2_34(34) R87.2  [also labelled UART4_RXD]
I2C2_SCL: I.MX6UL_CORE.J2_31(31) R84.2  [also labelled UART5_TXD]
I2C2_SDA: I.MX6UL_CORE.J2_32(32) R85.2  [also labelled UART5_RXD]
JTAG_nTRST: I.MX6UL_CORE.J2_21(21)  [also labelled SAI2_TX_DATA]
JTAG_TCK: I.MX6UL_CORE.J2_19(19)  [also labelled SAI2_RX_DATA]
JTAG_TDI: I.MX6UL_CORE.J2_17(17)  [also labelled SAI2_TX_BCLK]
JTAG_TDO: I.MX6UL_CORE.J2_18(18)  [also labelled SAI2_TX_SYNC]
JTAG_TMS: I.MX6UL_CORE.J2_20(20)  [also labelled SAI2_MCLK]
KEY0: I.MX6UL_CORE.J2_48(48)  [also labelled UART1_CTS]
LCD_DATA0: I.MX6UL_CORE.J1_7(7)  [project net LCD_B0]
LCD_DATA1: I.MX6UL_CORE.J1_8(8)  [project net LCD_B1]
LCD_DATA2: I.MX6UL_CORE.J1_9(9)  [project net LCD_B2]
LCD_DATA3: BOOT_CFG.13 I.MX6UL_CORE.J1_10(10)  [project net LCD_B3]
LCD_DATA4: BOOT_CFG.12 I.MX6UL_CORE.J1_11(11)  [project net LCD_B4]
LCD_DATA5: BOOT_CFG.11 I.MX6UL_CORE.J1_12(12)  [project net LCD_B5]
LCD_DATA6: BOOT_CFG.10 I.MX6UL_CORE.J1_13(13)  [project net LCD_B6]
LCD_DATA7: I.MX6UL_CORE.J1_14(14)
LCD_DATA8: I.MX6UL_CORE.J1_15(15)
LCD_DATA9: I.MX6UL_CORE.J1_16(16)
LCD_DATA10: I.MX6UL_CORE.J1_17(17)
LCD_DATA11: BOOT_CFG.14 I.MX6UL_CORE.J1_18(18)
LCD_DATA12: I.MX6UL_CORE.J1_19(19)
LCD_DATA13: I.MX6UL_CORE.J1_20(20)
LCD_DATA14: I.MX6UL_CORE.J1_21(21)
LCD_DATA15: I.MX6UL_CORE.J1_22(22)
LCD_DATA16: I.MX6UL_CORE.J1_23(23)
LCD_DATA17: I.MX6UL_CORE.J1_24(24)
LCD_DATA18: I.MX6UL_CORE.J1_25(25)
LCD_DATA19: I.MX6UL_CORE.J1_26(26)
LCD_DATA20: I.MX6UL_CORE.J1_27(27)
LCD_DATA21: I.MX6UL_CORE.J1_28(28)
LCD_DATA22: I.MX6UL_CORE.J1_29(29)
LCD_DATA23: I.MX6UL_CORE.J1_30(30)
LCD_DE: I.MX6UL_CORE.J1_46(46)
LCD_HSYNC: I.MX6UL_CORE.J1_44(44)
LCD_PCLK: I.MX6UL_CORE.J1_45(45)
LCD_VSYNC: I.MX6UL_CORE.J1_43(43)
nUSB_OTG_CHD: I.MX6UL_CORE.J2_52(52)
PMIC_ON_REQ: I.MX6UL_CORE.J1_41(41)
RESET: I.MX6UL_CORE.J1_40(40)
SD1_CLK: I.MX6UL_CORE.J1_54(54)
SD1_CMD: I.MX6UL_CORE.J1_53(53)
SD1_DATA0: I.MX6UL_CORE.J1_49(49)
SD1_DATA1: I.MX6UL_CORE.J1_50(50)
SD1_DATA2: I.MX6UL_CORE.J1_52(52)
SD1_DATA3: I.MX6UL_CORE.J1_51(51)
SNVS_TAMPER0: I.MX6UL_CORE.J2_5(5) P4.10  [also labelled WIFI_REG_ON]
SNVS_TAMPER2: I.MX6UL_CORE.J2_11(11) P4.9  [also labelled WIFI_INT]
UART1_RTS: I.MX6UL_CORE.J2_43(43) P4.11  [also labelled USDHC1_CD_B]
UART1_RXD: I.MX6UL_CORE.J2_46(46)
UART1_TXD: I.MX6UL_CORE.J2_50(50)
UART3_RXD: I.MX6UL_CORE.J2_37(37)
UART3_TXD: I.MX6UL_CORE.J2_38(38)
USB_OTG1_DN: I.MX6UL_CORE.J2_53(53)
USB_OTG1_DP: I.MX6UL_CORE.J2_54(54)
USB_OTG1_VBUS: I.MX6UL_CORE.J2_57(57)
USB_OTG2_DN: I.MX6UL_CORE.J2_55(55)
USB_OTG2_DP: I.MX6UL_CORE.J2_56(56)
USB_OTG2_VBUS: I.MX6UL_CORE.J2_58(58) R11.2
USDHC1_CLK: P4.8
USDHC1_CMD: P4.7
USDHC1_DATA0: P4.3
USDHC1_DATA1: P4.4
USDHC1_DATA2: P4.5
USDHC1_DATA3: P4.6
NetBOOT_CFG_1: BOOT_CFG.1 R88.2
NetBOOT_CFG_2: BOOT_CFG.2 R89.2
NetBOOT_CFG_3: BOOT_CFG.3 R90.2
NetBOOT_CFG_4: BOOT_CFG.4 R91.2
NetBOOT_CFG_5: BOOT_CFG.5 R93.2
NetBOOT_CFG_6: BOOT_CFG.6 R95.2
NetBOOT_CFG_7: BOOT_CFG.7 R97.2
NetBOOT_CFG_8: BOOT_CFG.8 R98.2
NetC81_1: C81.1 I.MX6UL_CORE.J2_1(1) L9.2 R11.1
NetC96_1: C96.1 L9.1

Not connected (* = marked no-connect by the designer): P4 12*

### Notes on the sheet
- CORE
- WIFI
- BOOT
- I2C
- (in symbol CSW-8P) OFF; ON

### Library data of the parts
BOOT_CFG = CSW-8P: 8路编码开关; 版权归属: 源创客; BOM名称: 8路编码开关; 学习资源: www.ooocke.com
C81 C96 = C
I.MX6UL_CORE = I.MX6UL核心板
L9 = L: 小功率贴片电感磁珠; 版权归属: 源创客; BOM名称: 小功率贴片电感; 学习资源: www.ooocke.com
P4 = Header 6X2: Header, 6-Pin, Dual row; LatestRevisionDate: 17-Jul-2002; LatestRevisionNote: Re-released for DXP Platform.; Publisher: Altium Limited
R11 R74 R75 R84-R91 R93 R95 R97 R98 = R

## Sheet Sheet5.SchDoc
size A4
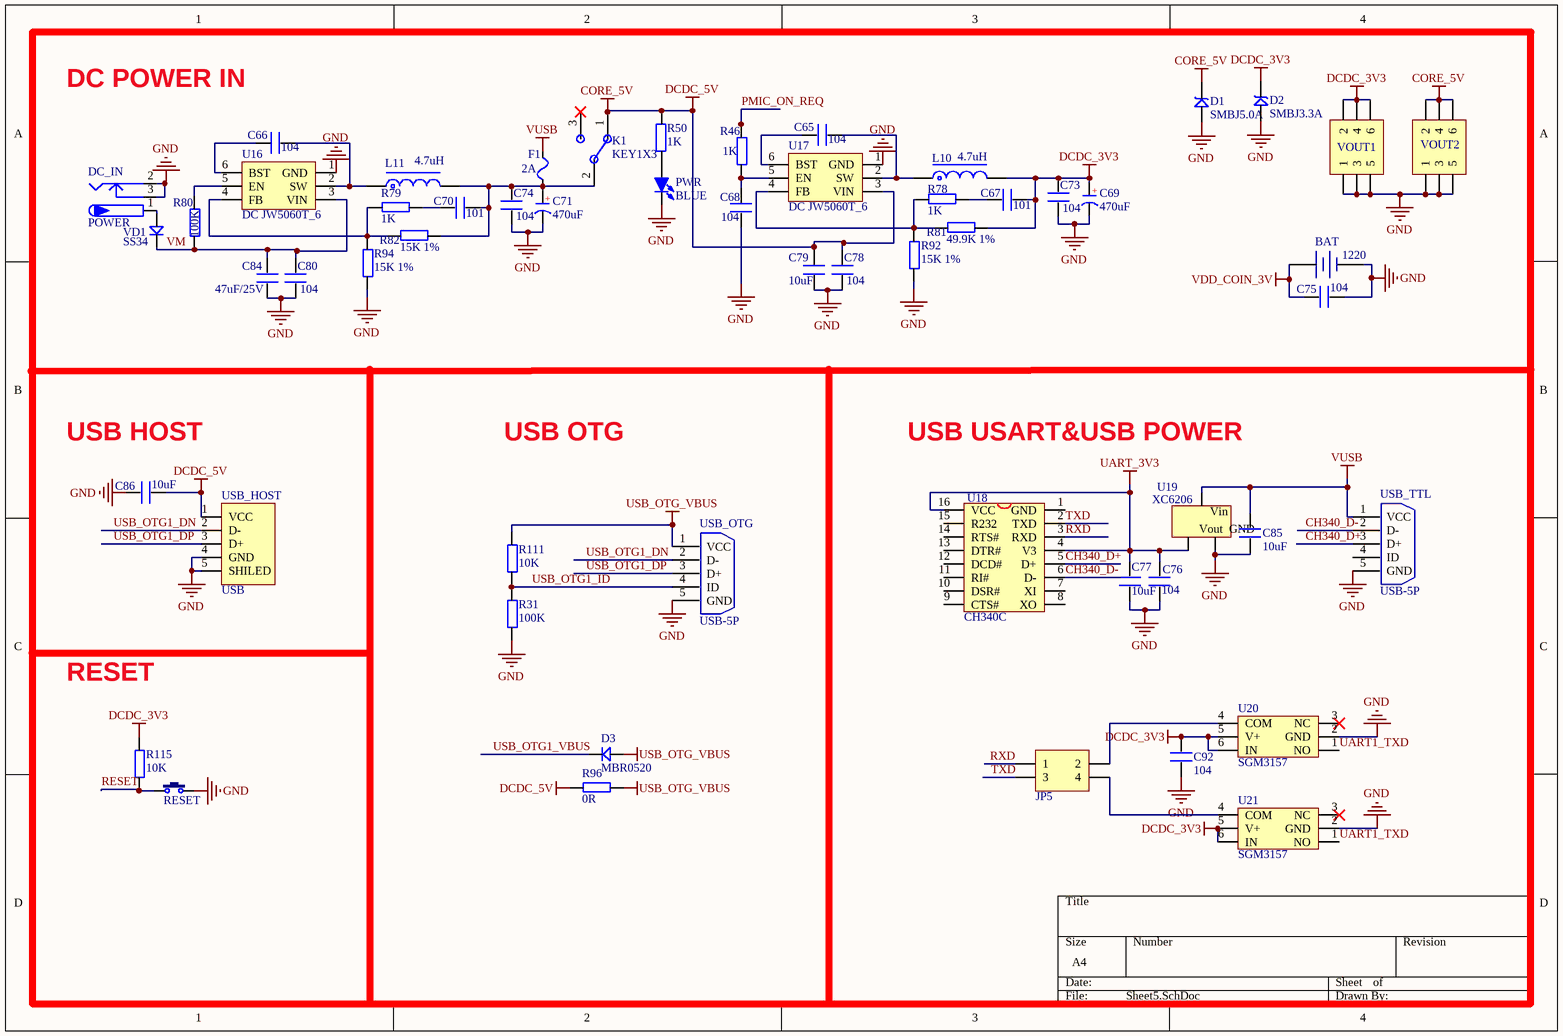
[diagram p4: Sheet5.SchDoc]

### Parts
BAT  1220  [CR1220_B]
C65  104  [C 0603]
C66  104  [C 0603]
C67  101  [C 0603]
C68  104  [C 0603]
C69  470uF  [CM D(6.3*5.4)]
C70  101  [C 0603]
C71  470uF  [CM D(6.3*5.4)]
C73  104  [C 0603]
C74  104  [C 0603]
C75  104  [C 0603]
C76  104  [C 0603]
C77  10uF  [C 0603]
C78  104  [C 0603]
C79  10uF  [C 0603]
C80  104  [C 0603]
C84  47uF/25V  [C 0603]
C85  10uF  [C 0603]
C86  10uF  [C 0603]
C92  104  [C 0603]
D1  SMBJ5.0A  [SMBJ]
D2  SMBJ3.3A  [SMBJ]
D3  MBR0520  [SOD-123F]
DC_IN  POWER  [DC10B]
F1  2A  [FU 1206]
JP5  Header2X2  [HDR-2X2]  (value not drawn)
K1  KEY1X3  [PKEY]
L10  4.7uH  [L-SMD-0420]
L11  4.7uH  [L-SMD-0420]
PWR  BLUE  [LED 0805R]
R31  100K  [R 0603]
R46  1K  [R 0603]
R50  1K  [R 0603]
R78  1K  [R 0603]
R79  1K  [R 0603]
R80  100K  [R 0603]
R81  49.9K 1%  [R 0603]
R82  15K 1%  [R 0603]
R92  15K 1%  [R 0603]
R94  15K 1%  [R 0603]
R96  0R  [R 0603]
R111  10K  [R 0603]
R115  10K  [R 0603]
RESET  KEY  [TSW DIP-6*6*5 - 2]  (value not drawn)
U16  DC JW5060T_6  [SOT23-6N]
U17  DC JW5060T_6  [SOT23-6N]
U18  CH340C  [SOP16_N]
U19  XC6206  [SOT23-3N]
U20  SGM3157  [SOT363-6L]
U21  SGM3157  [SOT363-6L]
USB_HOST  USB  [USB-A/S_E]
USB_OTG  USB-5P  [USB-MINI-A]
USB_TTL  USB-5P  [USB-MINI-A]
VD1  SS34  [SOD-323]
VOUT1  RS232/RS485  [HDR-3X2]  (value not drawn)
VOUT2  RS232/RS485  [HDR-3X2]  (value not drawn)

### Nets
CORE_5V: C78.2 C79.2 C86.1 D1.2 K1.1 R50.1 R96.2 U17.3(VIN) USB_HOST.1(VCC) VOUT2.2 VOUT2.4 VOUT2.6  [also labelled DCDC_5V]
DCDC_3V3: C67.2 C69.1(A) C73.2 C92.2 D2.2 L10.2 R81.1 R115.2 U20.5(V+) U20.6(IN) U21.5(V+) U21.6(IN) VOUT1.2 VOUT1.4 VOUT1.6
GND: BAT.2(DC-) C68.1 C69.2(K) C71.2(K) C73.1 C74.1 C75.2 C76.1 C77.1 C78.1 C79.1 C80.1 C84.1 C85.1 C86.2 C92.1 D1.1 D2.1 DC_IN.2 DC_IN.3 PWR.2(K) R31.1 R92.1 R94.1 RESET.2 U16.1(GND) U17.1(GND) U19.1(GND) U20.2(GND) U21.2(GND) USB_HOST.4(GND) USB_HOST.5(SHILED) USB_OTG.5(GND) USB_TTL.5(GND) VOUT1.1 VOUT1.3 VOUT1.5 VOUT2.1 VOUT2.3 VOUT2.5
UART_3V3: C76.2 C77.2 U18.4(V3) U18.16(VCC) U19.2(Vout)
USB_OTG_VBUS: D3.1(A) R96.1 R111.2 USB_OTG.1(VCC)
VDD_COIN_3V: BAT.1(DC+) C75.1
VUSB: C85.2 F1.2 U19.3(Vin) USB_TTL.1(VCC)
CH340_D+: U18.5(D+) USB_TTL.3(D+)
CH340_D-: U18.6(D-) USB_TTL.2(D-)
PMIC_ON_REQ: R46.2
RESET: R115.1 RESET.1
RXD: JP5.1 U18.3(RXD)
TXD: JP5.3 U18.2(TXD)
UART1_TXD: U20.1(NO) U21.1(NO)
USB_OTG1_DN: USB_HOST.2(D-) USB_OTG.2(D-)
USB_OTG1_DP: USB_HOST.3(D+) USB_OTG.3(D+)
USB_OTG1_ID: R31.2 R111.1 USB_OTG.4(ID)  [project net GPIO0]
USB_OTG1_VBUS: D3.2(K)
VM: C80.2 C84.2 R80.1 U16.3(VIN) VD1.2(K)
NetC65_1: C65.1 U17.6(BST)
NetC65_2: C65.2 L10.1 U17.2(SW)
NetC66_1: C66.1 U16.6(BST)
NetC66_2: C66.2 L11.1 U16.2(SW)
NetC67_1: C67.1 R78.1
NetC68_2: C68.2 R46.1 U17.5(EN)
NetC70_1: C70.1 R79.1
NetC70_2: C70.2 C71.1(A) C74.2 F1.1 K1.2 L11.2 R82.1
NetDC_IN_1: DC_IN.1 VD1.1(A)
NetJP5_2: JP5.2 U20.4(COM)
NetJP5_4: JP5.4 U21.4(COM)
NetPWR_1: PWR.1(A) R50.2
NetR78_2: R78.2 R81.2 R92.2 U17.4(FB)
NetR79_2: R79.2 R82.2 R94.2 U16.4(FB)
NetR80_2: R80.2 U16.5(EN)

Not connected (* = marked no-connect by the designer): K1 3*; U18 1(GND) 7(XI) 8(XO) 9(CTS#) 10(DSR#) 11(RI#) 12(DCD#) 13(DTR#) 14(RTS#) 15(R232); U20 3(NC)*; U21 3(NC)*; USB_TTL 4(ID)

### Notes on the sheet
- DC POWER IN
- (near C86) USB HOST
- USB OTG
- USB USART&USB POWER
- RESET
- (in symbol C-CM) +

### Library data of the parts
BAT = CR-3V: 微型电池; 版权归属: 源创客; BOM名称: 微型电池; 学习资源: www.ooocke.com
C65-C68 C70 C73-C80 C84-C86 C92 = C
C69 C71 = C-CM: 贴片电解电容; 版权归属: 源创客; BOM名称: 贴片电解电容; 学习资源: www.ooocke.com
D1 D2 = SMBJ: TVS
D3 VD1 = SS14: 肖特基二极管; 版权归属: 源创客; 属性: 40V/1A; BOM名称: 肖特基二极管; 学习资源: www.ooocke.com
DC_IN = P-DC: 低压电源接口; BOM名称: DC电源接口; 版权归属: 源创客; 学习资源: www.ooocke.com
F1 = FU: 贴片保险丝; 版权归属: 源创客; BOM名称: 贴片保险丝; 学习资源: www.ooocke.com
JP5 = Header 2X2: 2*2P接插件; 版权归属: 源创客; BOM名称: 2*2P接插件; 学习资源: www.ooocke.com
K1 = PKEY
L10 L11 = L-CDRH: 功率屏蔽电感; 版权归属: 源创客; BOM名称: 功率屏蔽电感; 学习资源: www.ooocke.com
PWR = LED-SMD: 贴片LED; 版权归属: 源创客; BOM名称: 贴片LED; 学习资源: www.ooocke.com
R31 R46 R50 R78-R82 R92 R94 R96 R111 R115 = R
RESET = KEY: 按键; BOM名称: 3x6轻触开关; 版权归属: 源创客; 学习资源: www.ooocke.com
U16 U17 = DC JW5060T_6: DC降压芯片
U18 = CH340G: USB2UART
U19 = LDO XC6206: LDO; ComponentLink1Description: 供应商链接; ComponentLink1URL: http://www.szlcsc.com/product/details_5896.html; Package: SOT-23; Supplier: LC; SuppliersPartNumber: C5446
U20 U21 = SGM3157: 单路双掷模拟开关
USB_HOST = USB-A/S: USB-A型母接口; 版权归属: 源创客; BOM名称: USB-A型母接口; 学习资源: www.ooocke.com
USB_OTG USB_TTL = USB-5P: 微型USB母座; 版权归属: 源创客; BOM名称: 微型USB母座; 学习资源: www.ooocke.com
VOUT1 VOUT2 = Header 3X2: 3*2P接插件; 版权归属: 源创客; BOM名称: 3*2P接插件; 学习资源: www.ooocke.com

## Nets that join several sheets
3V3_DCDC: Sheet1 (27 pins), Sheet3 (C47.2 L1.1), Sheet4 (13 pins)
5V_DCDC: Sheet1 (5 pins), Sheet4 (C81.2 C96.2)
CORE_5V: Sheet2 (11 pins), Sheet5 (12 pins)
DCDC_3V3: Sheet2 (11 pins), Sheet5 (15 pins)
GND: Sheet1 (48 pins), Sheet2 (44 pins), Sheet3 (31 pins), Sheet4 (I.MX6UL_CORE.J2_59 I.MX6UL_CORE.J2_60 P4.2), Sheet5 (40 pins)
VDD_COIN_3V: Sheet4 (I.MX6UL_CORE.J1_42), Sheet5 (BAT.1 C75.1)
6D_INT: Sheet1 (U6.6), Sheet3 (JP6.14), Sheet4 (I.MX6UL_CORE.J2_22)
AP_INT: Sheet2 (U9.7), Sheet3 (JP6.17), Sheet4 (I.MX6UL_CORE.J2_49)
AUD_INT: Sheet2 (R51.1 R52.2), Sheet3 (JP6.29 JP6.31), Sheet4 (I.MX6UL_CORE.J2_2 I.MX6UL_CORE.J2_3)
BEEP: Sheet1 (R18.1), Sheet3 (JP6.30), Sheet4 (I.MX6UL_CORE.J2_4)
BLT_PWM: Sheet1 (R16.1 RGBLCD.34), Sheet3 (JP6.13), Sheet4 (I.MX6UL_CORE.J2_15 I.MX6UL_CORE.J2_16)
BOOT_DATA7: Sheet1 (U5.3), Sheet4 (BOOT_CFG.9)
BOOT_MODE0: Sheet3 (JP6.28), Sheet4 (BOOT_CFG.15 I.MX6UL_CORE.J2_6)
BOOT_MODE1: Sheet3 (JP6.25), Sheet4 (BOOT_CFG.16 I.MX6UL_CORE.J2_7)
CAN1_RX: Sheet1 (U4.4), Sheet3 (JP6.5), Sheet4 (I.MX6UL_CORE.J2_35)
CAN1_TX: Sheet1 (U4.1), Sheet3 (JP6.6), Sheet4 (I.MX6UL_CORE.J2_36)
CAN2_RX: Sheet1 (U6.4), Sheet3 (JP6.10), Sheet4 (I.MX6UL_CORE.J2_40)
CAN2_TX: Sheet1 (U6.3), Sheet3 (JP6.9), Sheet4 (I.MX6UL_CORE.J2_39)
CSI_DATA0: Sheet1 (P1.8), Sheet4 (I.MX6UL_CORE.J1_56)
CSI_DATA1: Sheet1 (P1.9), Sheet4 (I.MX6UL_CORE.J1_57)
CSI_DATA2: Sheet1 (P1.10), Sheet4 (I.MX6UL_CORE.J1_3)
CSI_DATA3: Sheet1 (P1.11), Sheet4 (I.MX6UL_CORE.J1_59)
CSI_DATA4: Sheet1 (P1.12), Sheet4 (I.MX6UL_CORE.J1_55)
CSI_DATA5: Sheet1 (P1.13), Sheet4 (I.MX6UL_CORE.J1_6)
CSI_DATA6: Sheet1 (P1.14), Sheet4 (I.MX6UL_CORE.J1_4)
CSI_DATA7: Sheet1 (P1.15), Sheet4 (I.MX6UL_CORE.J1_58)
CSI_HSYNC: Sheet1 (P1.5), Sheet4 (I.MX6UL_CORE.J1_1)
CSI_MCLK: Sheet1 (P1.17), Sheet4 (I.MX6UL_CORE.J1_2)
CSI_PIXCLK: Sheet1 (P1.16), Sheet4 (I.MX6UL_CORE.J1_5)
CSI_PWDN: Sheet1 (P1.18 R7.1), Sheet3 (JP6.20), Sheet4 (I.MX6UL_CORE.J2_13)
CSI_RESET: Sheet1 (P1.7 R3.1), Sheet3 (JP6.19), Sheet4 (I.MX6UL_CORE.J2_12)
CSI_VSYNC: Sheet1 (P1.3), Sheet4 (I.MX6UL_CORE.J1_60)
CT_INT: Sheet1 (C87.2 R12.1 RGBLCD.39), Sheet3 (JP6.16), Sheet4 (I.MX6UL_CORE.J2_14)
CT_RST: Sheet1 (R14.1 RGBLCD.35), Sheet4 (I.MX6UL_CORE.J1_48)
ECSPI3_SCLK: Sheet1 (U6.2), Sheet3 (JP6.11), Sheet4 (I.MX6UL_CORE.J2_41)
ECSPI3_SS0: Sheet1 (R17.2 U6.5), Sheet3 (JP6.12), Sheet4 (I.MX6UL_CORE.J2_42)
ENET1_CRS_DV: Sheet3 (U14.11), Sheet4 (I.MX6UL_CORE.J2_25)
ENET1_INT_TREE#: Sheet3 (JP6.24 R63.2 U14.14), Sheet4 (I.MX6UL_CORE.J2_10)
ENET1_RST: Sheet3 (C54.2 JP6.23 R65.2 U14.15), Sheet4 (I.MX6UL_CORE.J2_9)
ENET1_RXD0: Sheet3 (U14.8), Sheet4 (I.MX6UL_CORE.J2_26)
ENET1_RXD1: Sheet3 (U14.7), Sheet4 (I.MX6UL_CORE.J2_24)
ENET1_RXER: Sheet3 (R13.2 U14.10), Sheet4 (I.MX6UL_CORE.J2_30)
ENET1_TX_CLK: Sheet3 (U14.5), Sheet4 (I.MX6UL_CORE.J2_29)
ENET1_TXD0: Sheet3 (U14.17), Sheet4 (I.MX6UL_CORE.J2_23)
ENET1_TXD1: Sheet3 (U14.18), Sheet4 (I.MX6UL_CORE.J2_28)
ENET1_TXEN: Sheet3 (U14.16), Sheet4 (I.MX6UL_CORE.J2_27)
ENET2_CRS_DV: Sheet3 (U15.11), Sheet4 (I.MX6UL_CORE.J1_33)
ENET2_INT_TREE#: Sheet3 (R71.2 U15.14), Sheet4 (I.MX6UL_CORE.J1_39)
ENET2_RST: Sheet3 (C64.2 JP6.26 R72.2 U15.15), Sheet4 (I.MX6UL_CORE.J2_8)
ENET2_RXD0: Sheet3 (U15.8), Sheet4 (I.MX6UL_CORE.J1_38)
ENET2_RXD1: Sheet3 (U15.7), Sheet4 (I.MX6UL_CORE.J1_37)
ENET2_RXER: Sheet3 (R70.2 U15.10), Sheet4 (I.MX6UL_CORE.J1_34)
ENET2_TX_CLK: Sheet3 (U15.5), Sheet4 (I.MX6UL_CORE.J1_31)
ENET2_TXD0: Sheet3 (U15.17), Sheet4 (I.MX6UL_CORE.J1_36)
ENET2_TXD1: Sheet3 (U15.18), Sheet4 (I.MX6UL_CORE.J1_35)
ENET2_TXEN: Sheet3 (U15.16), Sheet4 (I.MX6UL_CORE.J1_32)
ENET_MDC: Sheet3 (R55.1 U14.13 U15.13), Sheet4 (R74.2)
ENET_MDIO: Sheet3 (R56.1 U14.12 U15.12), Sheet4 (R75.2)
GPIO0: Sheet3 (JP6.21), Sheet4 (I.MX6UL_CORE.J2_51), Sheet5 (R31.2 R111.1 USB_OTG.4)
GPIO3: Sheet1 (DS0.2), Sheet3 (JP6.15), Sheet4 (I.MX6UL_CORE.J2_47)
I2C1_SCL: Sheet2 (U9.2), Sheet3 (JP6.3), Sheet4 (I.MX6UL_CORE.J2_33 R86.2)
I2C1_SDA: Sheet2 (U9.8), Sheet3 (JP6.4), Sheet4 (I.MX6UL_CORE.J2_34 R87.2)
I2C2_SCL: Sheet1 (P1.4 RGBLCD.38), Sheet2 (U13.17), Sheet3 (JP6.1), Sheet4 (I.MX6UL_CORE.J2_31 R84.2)
I2C2_SDA: Sheet1 (P1.6 RGBLCD.36), Sheet2 (U13.18), Sheet3 (JP6.2), Sheet4 (I.MX6UL_CORE.J2_32 R85.2)
JTAG_nTRST: Sheet2 (U13.14), Sheet4 (I.MX6UL_CORE.J2_21)
JTAG_TCK: Sheet2 (U13.16), Sheet4 (I.MX6UL_CORE.J2_19)
JTAG_TDI: Sheet2 (U13.12), Sheet4 (I.MX6UL_CORE.J2_17)
JTAG_TDO: Sheet2 (U13.13), Sheet4 (I.MX6UL_CORE.J2_18)
JTAG_TMS: Sheet2 (U13.11), Sheet4 (I.MX6UL_CORE.J2_20)
KEY0: Sheet1 (KEY0.1 R15.2), Sheet3 (JP6.18), Sheet4 (I.MX6UL_CORE.J2_48)
LCD_B0: Sheet1 (RGBLCD.21), Sheet4 (I.MX6UL_CORE.J1_7)
LCD_B1: Sheet1 (RGBLCD.22), Sheet4 (I.MX6UL_CORE.J1_8)
LCD_B2: Sheet1 (RGBLCD.23), Sheet4 (I.MX6UL_CORE.J1_9)
LCD_B3: Sheet1 (RGBLCD.24), Sheet4 (BOOT_CFG.13 I.MX6UL_CORE.J1_10)
LCD_B4: Sheet1 (RGBLCD.25), Sheet4 (BOOT_CFG.12 I.MX6UL_CORE.J1_11)
LCD_B5: Sheet1 (RGBLCD.26), Sheet4 (BOOT_CFG.11 I.MX6UL_CORE.J1_12)
LCD_B6: Sheet1 (RGBLCD.27), Sheet4 (BOOT_CFG.10 I.MX6UL_CORE.J1_13)
LCD_DATA7: Sheet1 (R120.1 U5.4), Sheet4 (I.MX6UL_CORE.J1_14)
LCD_DATA8: Sheet1 (RGBLCD.12), Sheet4 (I.MX6UL_CORE.J1_15)
LCD_DATA9: Sheet1 (RGBLCD.13), Sheet4 (I.MX6UL_CORE.J1_16)
LCD_DATA10: Sheet1 (RGBLCD.14), Sheet4 (I.MX6UL_CORE.J1_17)
LCD_DATA11: Sheet1 (RGBLCD.15), Sheet4 (BOOT_CFG.14 I.MX6UL_CORE.J1_18)
LCD_DATA12: Sheet1 (RGBLCD.16), Sheet4 (I.MX6UL_CORE.J1_19)
LCD_DATA13: Sheet1 (RGBLCD.17), Sheet4 (I.MX6UL_CORE.J1_20)
LCD_DATA14: Sheet1 (RGBLCD.18), Sheet4 (I.MX6UL_CORE.J1_21)
LCD_DATA15: Sheet1 (R114.1 U2.4), Sheet4 (I.MX6UL_CORE.J1_22)
LCD_DATA16: Sheet1 (RGBLCD.3), Sheet4 (I.MX6UL_CORE.J1_23)
LCD_DATA17: Sheet1 (RGBLCD.4), Sheet4 (I.MX6UL_CORE.J1_24)
LCD_DATA18: Sheet1 (RGBLCD.5), Sheet4 (I.MX6UL_CORE.J1_25)
LCD_DATA19: Sheet1 (RGBLCD.6), Sheet4 (I.MX6UL_CORE.J1_26)
LCD_DATA20: Sheet1 (RGBLCD.7), Sheet4 (I.MX6UL_CORE.J1_27)
LCD_DATA21: Sheet1 (RGBLCD.8), Sheet4 (I.MX6UL_CORE.J1_28)
LCD_DATA22: Sheet1 (RGBLCD.9), Sheet4 (I.MX6UL_CORE.J1_29)
LCD_DATA23: Sheet1 (R116.1 U3.4), Sheet4 (I.MX6UL_CORE.J1_30)
LCD_DE: Sheet1 (R35.2 RGBLCD.33), Sheet4 (I.MX6UL_CORE.J1_46)
LCD_HSYNC: Sheet1 (RGBLCD.31), Sheet4 (I.MX6UL_CORE.J1_44)
LCD_VSYNC: Sheet1 (R36.2 RGBLCD.32), Sheet4 (I.MX6UL_CORE.J1_43)
PMIC_ON_REQ: Sheet4 (I.MX6UL_CORE.J1_41), Sheet5 (R46.2)
RESET: Sheet1 (RGBLCD.40), Sheet4 (I.MX6UL_CORE.J1_40), Sheet5 (R115.1 RESET.1)
SD1_CLK: Sheet1 (R100_4.2), Sheet4 (I.MX6UL_CORE.J1_54)
SD1_CMD: Sheet1 (R100_3.2), Sheet4 (I.MX6UL_CORE.J1_53)
SD1_DATA0: Sheet1 (R99_1.1), Sheet4 (I.MX6UL_CORE.J1_49)
SD1_DATA1: Sheet1 (R99_2.1), Sheet4 (I.MX6UL_CORE.J1_50)
SD1_DATA2: Sheet1 (R100_2.2), Sheet4 (I.MX6UL_CORE.J1_52)
SD1_DATA3: Sheet1 (R100_1.2), Sheet4 (I.MX6UL_CORE.J1_51)
SNVS_TAMPER0: Sheet3 (JP6.27), Sheet4 (I.MX6UL_CORE.J2_5 P4.10)
SNVS_TAMPER2: Sheet3 (JP6.22), Sheet4 (I.MX6UL_CORE.J2_11 P4.9)
UART1_RTS: Sheet1 (R8.1 TF_CARD.9), Sheet4 (I.MX6UL_CORE.J2_43 P4.11)
UART1_TXD: Sheet4 (I.MX6UL_CORE.J2_50), Sheet5 (U20.1 U21.1)
UART3_RXD: Sheet1 (JP1.4), Sheet2 (JP2.4), Sheet3 (JP6.7), Sheet4 (I.MX6UL_CORE.J2_37)
UART3_TXD: Sheet1 (JP1.3), Sheet3 (JP6.8), Sheet4 (I.MX6UL_CORE.J2_38)
USB_OTG1_DN: Sheet4 (I.MX6UL_CORE.J2_53), Sheet5 (USB_HOST.2 USB_OTG.2)
USB_OTG1_DP: Sheet4 (I.MX6UL_CORE.J2_54), Sheet5 (USB_HOST.3 USB_OTG.3)
USB_OTG1_VBUS: Sheet4 (I.MX6UL_CORE.J2_57), Sheet5 (D3.2)
USB_OTG2_DN: Sheet2 (U10.25), Sheet4 (I.MX6UL_CORE.J2_55)
USDHC1_CLK: Sheet1 (R100_4.1 TF_CARD.5), Sheet4 (P4.8)
USDHC1_CMD: Sheet1 (R4.1 R100_3.1 TF_CARD.3), Sheet4 (P4.7)
USDHC1_DATA0: Sheet1 (R5.1 R99_1.2 TF_CARD.7), Sheet4 (P4.3)
USDHC1_DATA1: Sheet1 (R6.1 R99_2.2 TF_CARD.8), Sheet4 (P4.4)
USDHC1_DATA2: Sheet1 (R1.1 R100_2.1 TF_CARD.1), Sheet4 (P4.5)
USDHC1_DATA3: Sheet1 (R2.1 R100_1.1 TF_CARD.2), Sheet4 (P4.6)